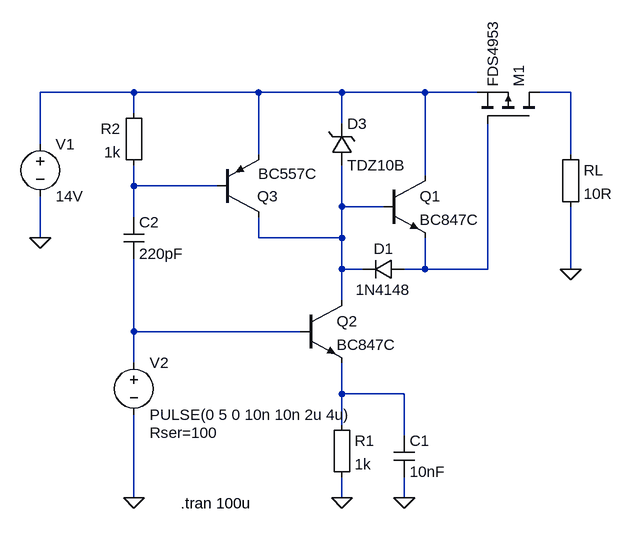
[diagram p0: schematic P-channel MOSFET shift_3.asc]
P-channel MOSFET shift_3.asc, the LTspice schematic file:
Version 4
SHEET 1 1044 680
WIRE -256 -96 -400 -96
WIRE -64 -96 -256 -96
WIRE 64 -96 -64 -96
WIRE 192 -96 64 -96
WIRE 272 -96 192 -96
WIRE 416 -96 368 -96
WIRE -256 -64 -256 -96
WIRE 64 -48 64 -96
WIRE -400 -16 -400 -96
WIRE -64 0 -64 -96
WIRE 416 0 416 -96
WIRE 192 32 192 -96
WIRE -256 48 -256 16
WIRE -128 48 -256 48
WIRE 64 80 64 16
WIRE 128 80 64 80
WIRE -256 96 -256 48
WIRE -400 128 -400 64
WIRE -64 128 -64 96
WIRE 64 128 64 80
WIRE 64 128 -64 128
WIRE 64 176 64 128
WIRE 96 176 64 176
WIRE 192 176 192 128
WIRE 192 176 160 176
WIRE 288 176 288 -48
WIRE 288 176 192 176
WIRE 416 176 416 80
WIRE 64 224 64 176
WIRE -256 272 -256 160
WIRE 0 272 -256 272
WIRE -256 320 -256 272
WIRE 64 368 64 320
WIRE 160 368 64 368
WIRE 64 416 64 368
WIRE 160 432 160 368
WIRE -256 528 -256 400
WIRE 64 528 64 496
WIRE 160 528 160 496
FLAG -400 128 0
FLAG 416 176 0
FLAG -256 528 0
FLAG 64 528 0
FLAG 160 528 0
SYMBOL npn 128 32 R0
SYMATTR InstName Q1
SYMATTR Value BC847C
SYMBOL Misc\\EuropeanResistor 48 400 R0
SYMATTR InstName R1
SYMATTR Value 1k
SYMBOL voltage -400 -32 R0
WINDOW 123 0 0 Left 2
WINDOW 39 0 0 Left 2
SYMATTR InstName V1
SYMATTR Value 14V
SYMBOL pmos 368 -48 M270
SYMATTR InstName M1
SYMATTR Value FDS4953
SYMBOL Misc\\EuropeanResistor 400 -16 R0
SYMATTR InstName RL
SYMATTR Value 10R
SYMBOL voltage -256 304 R0
WINDOW 123 0 0 Left 2
WINDOW 39 24 124 Left 2
SYMATTR SpiceLine Rser=100
SYMATTR InstName V2
SYMATTR Value PULSE(0 5 0 10n 10n 2u 4u)
SYMBOL diode 160 160 R90
WINDOW 0 0 32 VBottom 2
WINDOW 3 32 32 VTop 2
SYMATTR InstName D1
SYMATTR Value 1N4148
SYMBOL zener 48 16 M180
WINDOW 0 24 64 Left 2
WINDOW 3 24 0 Left 2
SYMATTR InstName D3
SYMATTR Value TDZ10B
SYMATTR Description Diode
SYMATTR Type diode
SYMBOL npn 0 224 R0
SYMATTR InstName Q2
SYMATTR Value BC847C
SYMBOL pnp -128 96 M180
WINDOW 0 62 32 Left 2
WINDOW 3 63 67 Left 2
SYMATTR InstName Q3
SYMATTR Value BC557C
SYMBOL Misc\\EuropeanResistor -240 -80 M0
SYMATTR InstName R2
SYMATTR Value 1k
SYMBOL cap -272 96 R0
SYMATTR InstName C2
SYMATTR Value 220pF
SYMBOL cap 144 432 R0
SYMATTR InstName C1
SYMATTR Value 10nF
TEXT -184 536 Left 2 !.tran 100u

The netlist it stands for:
* P-channel MOSFET shift_3.asc
Q1 N001 N004 N005 0 BC847C
R1 N007 0 1k
V1 N001 0 14V
M1 N002 N005 N001 N001 FDS4953
RL N002 0 10R
V2 N006 0 PULSE(0 5 0 10n 10n 2u 4u) Rser=100
D1 N005 N004 1N4148
D3 N004 N001 TDZ10B
Q2 N004 N006 N007 0 BC847C
Q3 N004 N003 N001 0 BC557C
R2 N001 N003 1k
C2 N003 N006 220pF
C1 N007 0 10nF
.model D D
.lib standard.dio
.model NPN NPN
.model PNP PNP
.lib standard.bjt
.model NMOS NMOS
.model PMOS PMOS
.lib standard.mos
.tran 100u
.backanno
.end